# Altium schematic sheet pwr_ctrl_rbf.SchDoc
size 297 x 209 mm
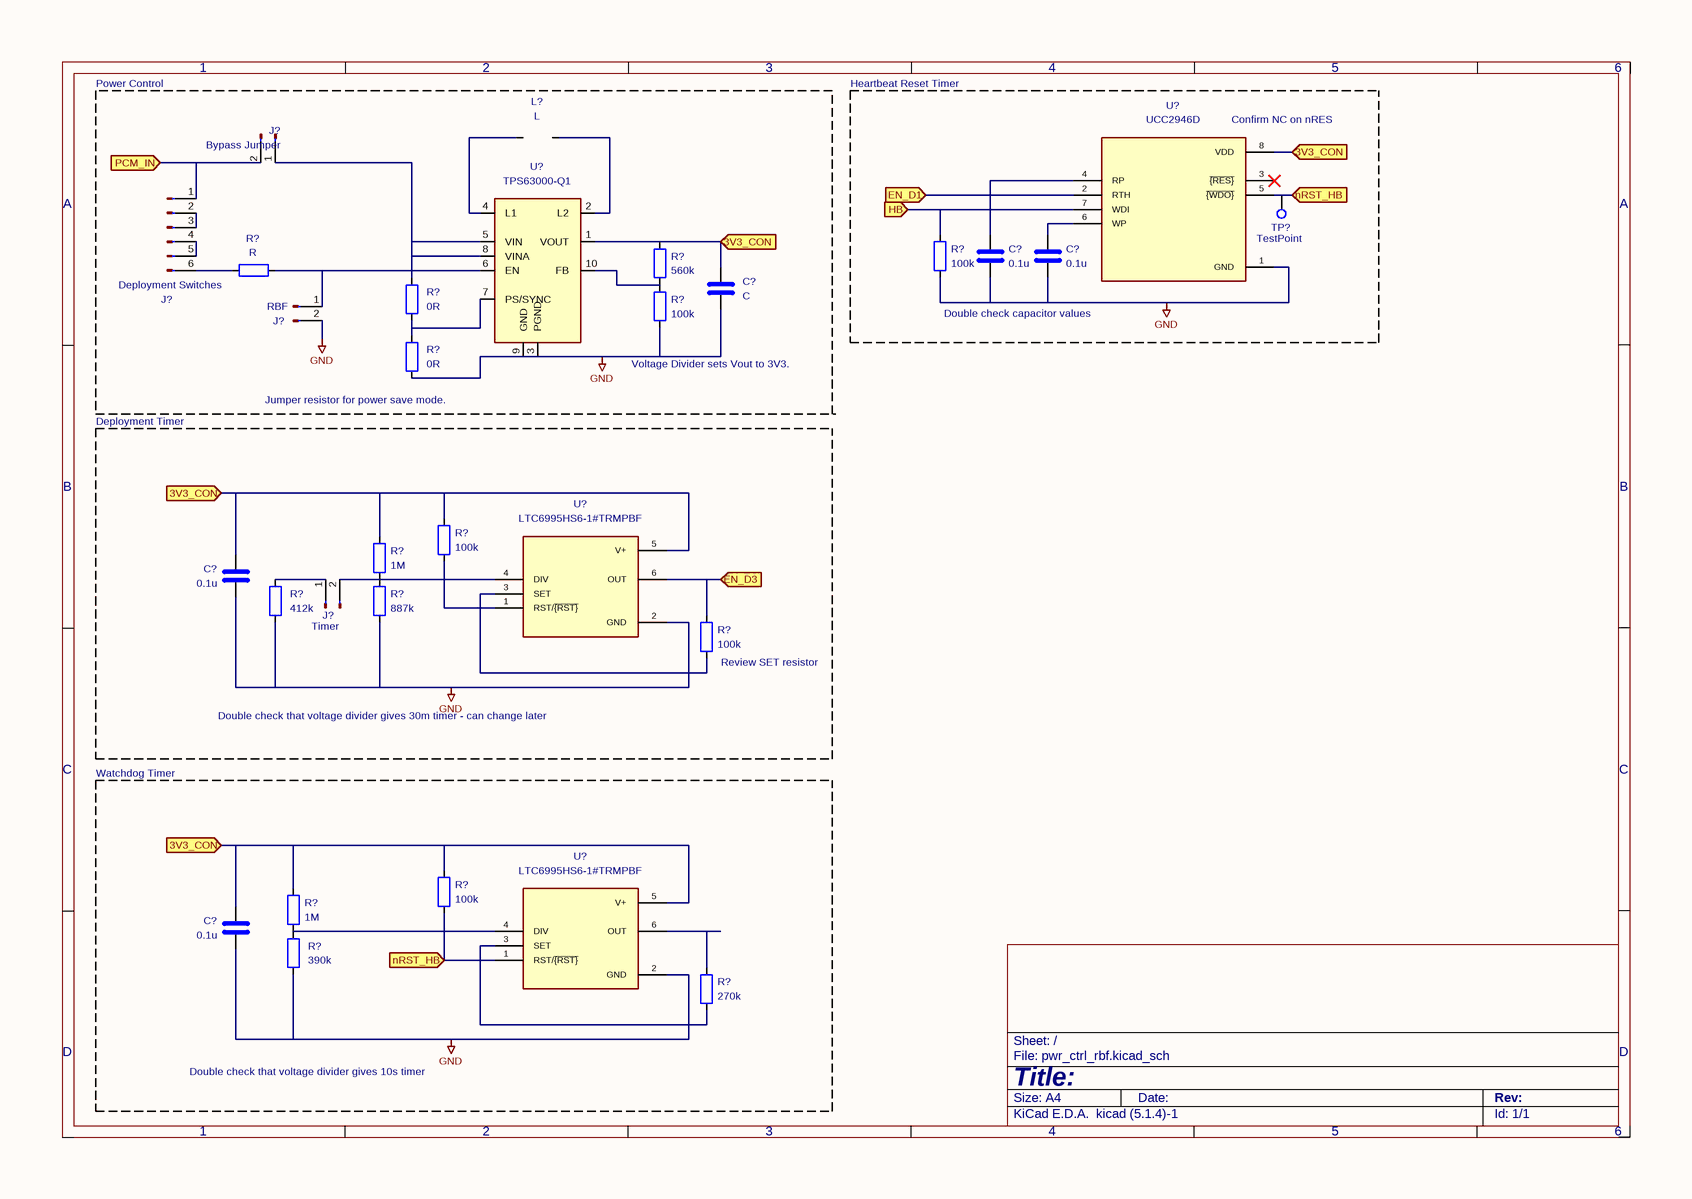
[diagram p0: pwr_ctrl_rbf.SchDoc]

## Parts
(Parts that share a designator on the sheet are numbered #1, #2 ... from top to bottom, then left to right.)
C?#1  0.1u
C?#2  0.1u
C?#3  C
C?#4  0.1u
C?#5  0.1u
J?#1  Bypass Jumper
J?#2  Deployment Switches
J?#3  RBF
J?#4  Timer
L?  L
R?#1  560k
R?#2  100k
R?#3  R
R?#4  0R
R?#5  100k
R?#6  0R
R?#7  100k
R?#8  1M
R?#9  412k
R?#10  887k
R?#11  100k
R?#12  100k
R?#13  1M
R?#14  390k
R?#15  270k
TP?  TestPoint
U?#1  UCC2946D  [SOIC127P599X175-8N]
U?#2  TPS63000-Q1  [Texas_DRC0010J_ThermalVias]
U?#3  LTC6995HS6-1#TRMPBF  [SOT95P280X100-6N]
U?#4  LTC6995HS6-1#TRMPBF  [SOT95P280X100-6N]

## Ports
3V3_CON (in), EN_D1 (in), EN_D3 (in), HB (in), nRST_HB (in), PCM_IN (in)

## Nets
GND: C?#1.2 C?#2.2 C?#3.2 C?#4.2 C?#5.2 J?#3.2(Pin_2) R?#2.2 R?#5.2 R?#6.2 R?#9.2 R?#10.2 R?#14.2 U?#1.1(GND) U?#2.3(PGND) U?#2.9(GND) U?#3.2(GND) U?#4.2(GND)
3V3_CON: C?#3.1 C?#4.1 C?#5.1 R?#1.1 R?#7.1 R?#8.1 R?#12.1 R?#13.1 U?#1.8(VDD) U?#2.1(VOUT) U?#3.5(V+) U?#4.5(V+) ; port 3V3_CON
EN_D1: U?#1.2(RTH) ; port EN_D1
EN_D3: R?#11.1 U?#3.6(OUT) ; port EN_D3
HB: R?#2.1 U?#1.7(WDI) ; port HB
nRST_HB: R?#12.2 TP?.1 U?#1.5(~{{WDO}}) U?#4.1(RST/~{{RST}}) ; port nRST_HB
PCM_IN: J?#1.2(Pin_2) J?#2.1(Pin_1) ; port PCM_IN
NetC?#1_1: C?#1.1 U?#1.4(RP)
NetC?#2_1: C?#2.1 U?#1.6(WP)
NetJ?#1_1: J?#1.1(Pin_1) R?#4.1 U?#2.5(VIN) U?#2.8(VINA)
NetJ?#2_2: J?#2.2(Pin_2) J?#2.3(Pin_3)
NetJ?#2_4: J?#2.4(Pin_4) J?#2.5(Pin_5)
NetJ?#2_6: J?#2.6(Pin_6) R?#3.1
NetJ?#3_1: J?#3.1(Pin_1) R?#3.2 U?#2.6(EN)
NetJ?#4_1: J?#4.1(Pin_1) R?#9.1
NetJ?#4_2: J?#4.2(Pin_2) R?#8.2 R?#10.1 U?#3.4(DIV)
NetL?_1: L?.1 U?#2.4(L1)
NetL?_2: L?.2 U?#2.2(L2)
NetR?#1_2: R?#1.2 R?#5.1 U?#2.10(FB)
NetR?#4_2: R?#4.2 R?#6.1 U?#2.7(PS/SYNC)
NetR?#7_2: R?#7.2 U?#3.1(RST/~{{RST}})
NetR?#11_2: R?#11.2 U?#3.3(SET)
NetR?#13_2: R?#13.2 R?#14.1 U?#4.4(DIV)
NetR?#15_1: R?#15.1 U?#4.6(OUT)
NetR?#15_2: R?#15.2 U?#4.3(SET)

Not connected (* = marked no-connect by the designer): U?#1 3(~{{RES}})*; U?#2 11(PGND)

## Notes on the sheet
- Power Control
- Heartbeat Reset Timer
- (near U?#1) Confirm NC on nRES
- Double check capacitor values
- Deployment Timer
- (near R?#6) Jumper resistor for power save mode.
- Voltage Divider sets Vout to 3V3.
- Double check that voltage divider
  gives 30m timer - can change later
- (near R?#11) Review SET resistor
- Watchdog Timer
- Double check that voltage divider
  gives 10s timer
- 1
- 2
- 3
- 4
- 5
- 6
- A
- B
- C
- D
- Title:
- File: pwr_ctrl_rbf.kicad_sch
- Sheet: /
- KiCad E.D.A.  kicad (5.1.4)-1
- Size: A4
- Date:
- Rev:
- Id: 1/1

## Library data of the parts
C?#1 C?#2 C?#4 C?#5 = C: Value: 0.1u
J?#1 J?#3 J?#4 = Conn_01x02_Male
  J?#1: Value: Bypass Jumper
  J?#3: Value: RBF
  J?#4: Value: Timer
J?#2 = Conn_01x06_Male: Value: Deployment Switches
R?#1 R?#2 R?#4-R?#15 = R
  R?#1: Value: 560k
  R?#2 R?#5 R?#7 R?#11 R?#12: Value: 100k
  R?#4 R?#6: Value: 0R
  R?#8 R?#13: Value: 1M
  R?#9: Value: 412k
  R?#10: Value: 887k
  R?#14: Value: 390k
  R?#15: Value: 270k
U?#3 U?#4 = LTC6995HS6-1#TRMPBF: MANUFACTURER: Analog Devices Inc.; PARTREV: Rev. B; STANDARD: IPC 7351B; MAXIMUM_PACKAGE_HEIGHT: 1.0mm; Value: LTC6995HS6-1#TRMPBF
C?#3 = C: Value: C
L? = L: Value: L
R?#3 = R: Value: R
TP? = TestPoint: Value: TestPoint
U?#1 = UCC2946D: Value: UCC2946D
U?#2 = TPS63000-Q1: Value: TPS63000-Q1; Footprint: Package_SON:Texas_DRC0010J_ThermalVias